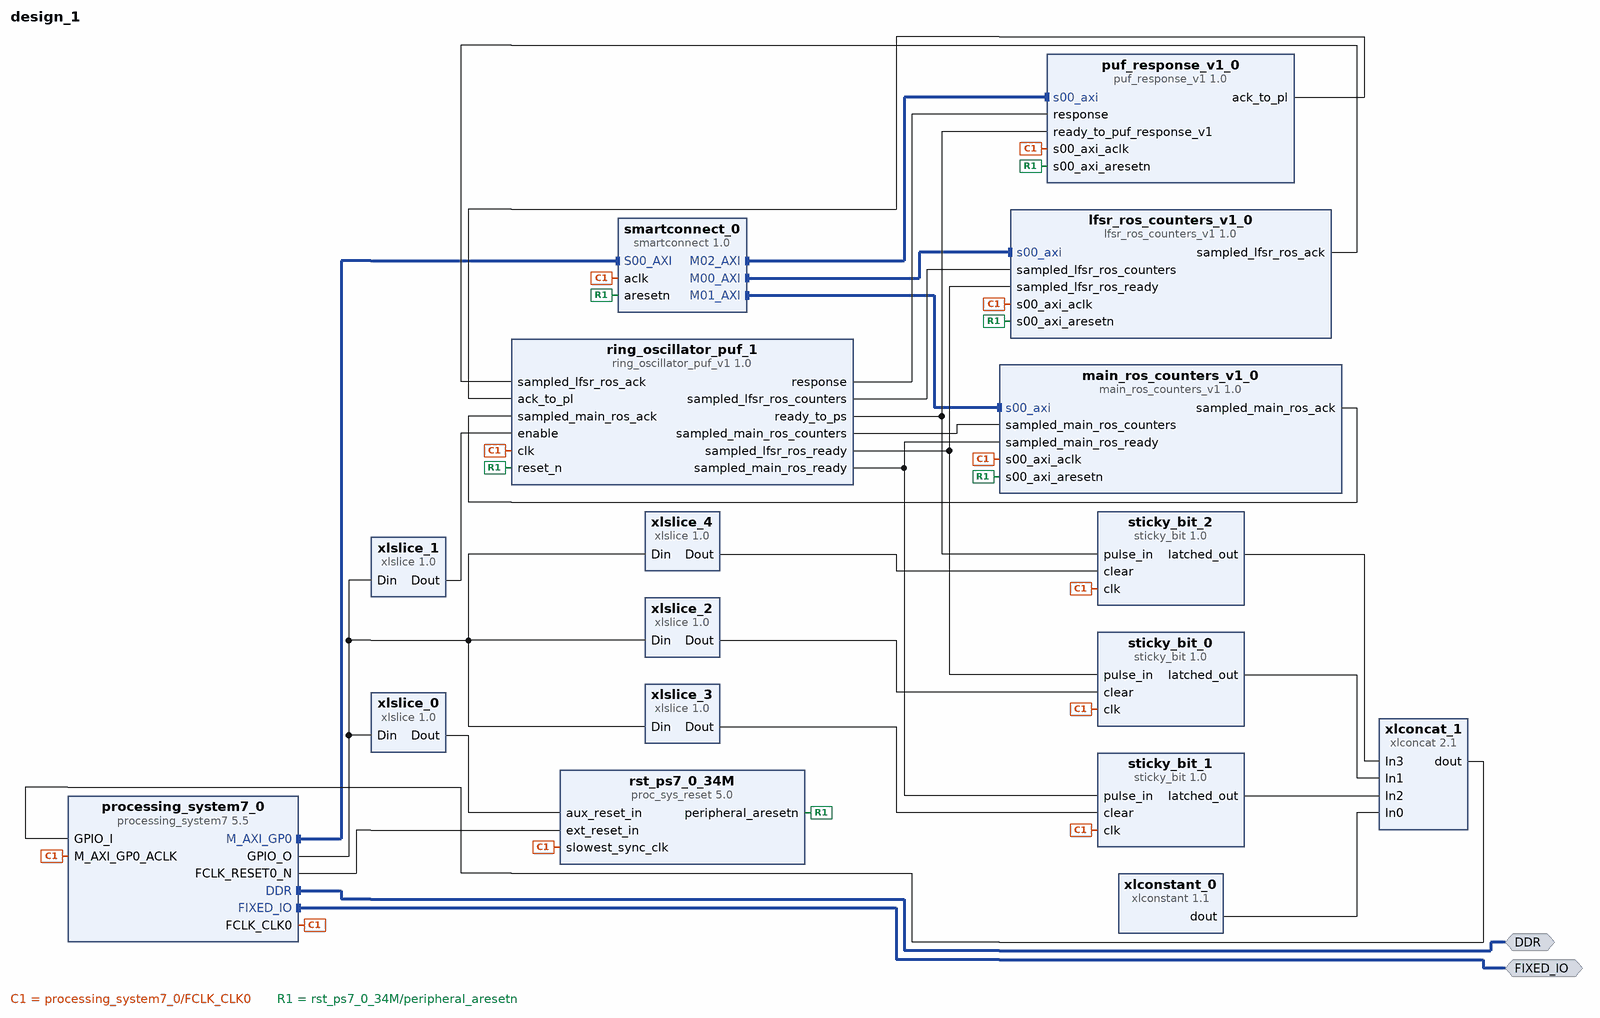
[diagram p0: block diagram of the top level]
# Vivado block design design_1, xc7z020clg400-1, Vivado 2022.1
create_bd_design design_1

create_bd_intf_port -mode Master -vlnv xilinx.com:interface:ddrx_rtl:1.0 DDR
create_bd_intf_port -mode Master -vlnv xilinx.com:display_processing_system7:fixedio_rtl:1.0 FIXED_IO

create_bd_cell -type ip -vlnv xilinx.com:ip:smartconnect:1.0 smartconnect_0
set_property -dict {CONFIG.NUM_MI 3 CONFIG.NUM_SI 1} [get_bd_cells smartconnect_0]
create_bd_cell -type ip -vlnv xilinx.com:ip:xlslice:1.0 xlslice_0
set_property -dict {CONFIG.DIN_WIDTH 8} [get_bd_cells xlslice_0]
create_bd_cell -type ip -vlnv xilinx.com:ip:xlslice:1.0 xlslice_1
set_property -dict {CONFIG.DIN_FROM 1 CONFIG.DIN_TO 1 CONFIG.DIN_WIDTH 8 CONFIG.DOUT_WIDTH 1} [get_bd_cells xlslice_1]
create_bd_cell -type ip -vlnv xilinx.com:ip:proc_sys_reset:5.0 rst_ps7_0_34M
create_bd_cell -type ip -vlnv xilinx.com:user:sticky_bit:1.0 sticky_bit_0
create_bd_cell -type ip -vlnv xilinx.com:user:sticky_bit:1.0 sticky_bit_1
create_bd_cell -type ip -vlnv xilinx.com:user:sticky_bit:1.0 sticky_bit_2
create_bd_cell -type ip -vlnv xilinx.com:ip:xlconcat:2.1 xlconcat_1
set_property -dict {CONFIG.NUM_PORTS 4} [get_bd_cells xlconcat_1]
create_bd_cell -type ip -vlnv xilinx.com:ip:xlconstant:1.1 xlconstant_0
set_property -dict {CONFIG.CONST_VAL 0 CONFIG.CONST_WIDTH 5} [get_bd_cells xlconstant_0]
create_bd_cell -type ip -vlnv xilinx.com:ip:xlslice:1.0 xlslice_2
set_property -dict {CONFIG.DIN_FROM 2 CONFIG.DIN_TO 2 CONFIG.DIN_WIDTH 8 CONFIG.DOUT_WIDTH 1} [get_bd_cells xlslice_2]
create_bd_cell -type ip -vlnv xilinx.com:ip:xlslice:1.0 xlslice_3
set_property -dict {CONFIG.DIN_FROM 3 CONFIG.DIN_TO 3 CONFIG.DIN_WIDTH 8 CONFIG.DOUT_WIDTH 1} [get_bd_cells xlslice_3]
create_bd_cell -type ip -vlnv xilinx.com:ip:xlslice:1.0 xlslice_4
set_property -dict {CONFIG.DIN_FROM 4 CONFIG.DIN_TO 4 CONFIG.DIN_WIDTH 8 CONFIG.DOUT_WIDTH 1} [get_bd_cells xlslice_4]
create_bd_cell -type ip -vlnv xilinx.com:ip:processing_system7:5.5 processing_system7_0
set_property -dict [list \
  CONFIG.PCW_APU_PERIPHERAL_FREQMHZ 666.666666 \
  CONFIG.PCW_CAN0_CAN0_IO {MIO 46 .. 47} \
  CONFIG.PCW_CAN0_PERIPHERAL_ENABLE 1 \
  CONFIG.PCW_CAN_PERIPHERAL_FREQMHZ 23.8095 \
  CONFIG.PCW_CRYSTAL_PERIPHERAL_FREQMHZ 50 \
  CONFIG.PCW_ENET0_ENET0_IO {MIO 16 .. 27} \
  CONFIG.PCW_ENET0_GRP_MDIO_ENABLE 1 \
  CONFIG.PCW_ENET0_GRP_MDIO_IO {MIO 52 .. 53} \
  CONFIG.PCW_ENET0_PERIPHERAL_ENABLE 1 \
  CONFIG.PCW_ENET0_PERIPHERAL_FREQMHZ {100 Mbps} \
  CONFIG.PCW_FPGA0_PERIPHERAL_FREQMHZ 50 \
  CONFIG.PCW_GPIO_EMIO_GPIO_ENABLE 1 \
  CONFIG.PCW_GPIO_EMIO_GPIO_IO 8 \
  CONFIG.PCW_GPIO_EMIO_GPIO_WIDTH 8 \
  CONFIG.PCW_GPIO_MIO_GPIO_ENABLE 0 \
  CONFIG.PCW_I2C0_GRP_INT_ENABLE 0 \
  CONFIG.PCW_I2C0_I2C0_IO {MIO 50 .. 51} \
  CONFIG.PCW_I2C0_PERIPHERAL_ENABLE 1 \
  CONFIG.PCW_I2C_PERIPHERAL_FREQMHZ 108.333336 \
  CONFIG.PCW_PRESET_BANK0_VOLTAGE {LVCMOS 1.8V} \
  CONFIG.PCW_PRESET_BANK1_VOLTAGE {LVCMOS 1.8V} \
  CONFIG.PCW_QSPI_GRP_FBCLK_ENABLE 1 \
  CONFIG.PCW_QSPI_GRP_FBCLK_IO {MIO 8} \
  CONFIG.PCW_QSPI_GRP_SINGLE_SS_ENABLE 1 \
  CONFIG.PCW_QSPI_GRP_SINGLE_SS_IO {MIO 1 .. 6} \
  CONFIG.PCW_QSPI_PERIPHERAL_ENABLE 1 \
  CONFIG.PCW_QSPI_QSPI_IO {MIO 1 .. 6} \
  CONFIG.PCW_SD0_GRP_CD_ENABLE 1 \
  CONFIG.PCW_SD0_GRP_CD_IO {MIO 0} \
  CONFIG.PCW_SD0_GRP_WP_ENABLE 1 \
  CONFIG.PCW_SD0_GRP_WP_IO {MIO 15} \
  CONFIG.PCW_SD0_PERIPHERAL_ENABLE 1 \
  CONFIG.PCW_SD0_SD0_IO {MIO 40 .. 45} \
  CONFIG.PCW_SDIO_PERIPHERAL_FREQMHZ 50 \
  CONFIG.PCW_SINGLE_QSPI_DATA_MODE x4 \
  CONFIG.PCW_UART1_PERIPHERAL_ENABLE 1 \
  CONFIG.PCW_UART1_UART1_IO {MIO 48 .. 49} \
  CONFIG.PCW_UART_PERIPHERAL_FREQMHZ 50 \
  CONFIG.PCW_UIPARAM_DDR_FREQ_MHZ 533.333333 \
  CONFIG.PCW_UIPARAM_DDR_PARTNO {MT41J256M8 HX-15E} \
  CONFIG.PCW_USB0_PERIPHERAL_ENABLE 1 \
  CONFIG.PCW_USB0_USB0_IO {MIO 28 .. 39} \
  CONFIG.preset ZC702 \
] [get_bd_cells processing_system7_0]
# 203 more settings of processing_system7_0 are not shown: defaults, MIO pin electricals, DDR timing, and values the tool derives
create_bd_cell -type ip -vlnv user.com:user:lfsr_ros_counters_v1:1.0 lfsr_ros_counters_v1_0
create_bd_cell -type ip -vlnv user.com:user:main_ros_counters_v1:1.0 main_ros_counters_v1_0
create_bd_cell -type ip -vlnv user.com:user:puf_response_v1:1.0 puf_response_v1_0
create_bd_cell -type ip -vlnv xilinx.com:user:ring_oscillator_puf_v1:1.0 ring_oscillator_puf_1
set_property -dict {CONFIG.g_clk_freq 50000000} [get_bd_cells ring_oscillator_puf_1]

# ---- connections ----

connect_bd_intf_net [get_bd_intf_ports DDR] [get_bd_intf_pins processing_system7_0/DDR]
connect_bd_intf_net [get_bd_intf_ports FIXED_IO] [get_bd_intf_pins processing_system7_0/FIXED_IO]
connect_bd_intf_net -intf_net processing_system7_1_M_AXI_GP0 [get_bd_intf_pins processing_system7_0/M_AXI_GP0] [get_bd_intf_pins smartconnect_0/S00_AXI]
connect_bd_intf_net [get_bd_intf_pins smartconnect_0/M00_AXI] [get_bd_intf_pins lfsr_ros_counters_v1_0/s00_axi]
connect_bd_intf_net [get_bd_intf_pins smartconnect_0/M01_AXI] [get_bd_intf_pins main_ros_counters_v1_0/s00_axi]
connect_bd_intf_net [get_bd_intf_pins puf_response_v1_0/s00_axi] [get_bd_intf_pins smartconnect_0/M02_AXI]
connect_bd_net [get_bd_pins lfsr_ros_counters_v1_0/sampled_lfsr_ros_ack] [get_bd_pins ring_oscillator_puf_1/sampled_lfsr_ros_ack]
connect_bd_net [get_bd_pins main_ros_counters_v1_0/sampled_main_ros_ack] [get_bd_pins ring_oscillator_puf_1/sampled_main_ros_ack]
connect_bd_net [get_bd_pins processing_system7_0/FCLK_CLK0] \
  [get_bd_pins smartconnect_0/aclk] [get_bd_pins rst_ps7_0_34M/slowest_sync_clk] [get_bd_pins sticky_bit_0/clk] \
  [get_bd_pins sticky_bit_1/clk] [get_bd_pins sticky_bit_2/clk] [get_bd_pins processing_system7_0/M_AXI_GP0_ACLK] \
  [get_bd_pins lfsr_ros_counters_v1_0/s00_axi_aclk] [get_bd_pins main_ros_counters_v1_0/s00_axi_aclk] \
  [get_bd_pins puf_response_v1_0/s00_axi_aclk] [get_bd_pins ring_oscillator_puf_1/clk]
connect_bd_net -net processing_system7_1_FCLK_RESET0_N [get_bd_pins processing_system7_0/FCLK_RESET0_N] [get_bd_pins rst_ps7_0_34M/ext_reset_in]
connect_bd_net -net processing_system7_1_GPIO_O [get_bd_pins processing_system7_0/GPIO_O] \
  [get_bd_pins xlslice_1/Din] [get_bd_pins xlslice_0/Din] [get_bd_pins xlslice_3/Din] [get_bd_pins xlslice_2/Din] \
  [get_bd_pins xlslice_4/Din]
connect_bd_net [get_bd_pins puf_response_v1_0/ack_to_pl] [get_bd_pins ring_oscillator_puf_1/ack_to_pl]
connect_bd_net [get_bd_pins ring_oscillator_puf_1/ready_to_ps] \
  [get_bd_pins sticky_bit_2/pulse_in] [get_bd_pins puf_response_v1_0/ready_to_puf_response_v1]
connect_bd_net [get_bd_pins ring_oscillator_puf_1/response] [get_bd_pins puf_response_v1_0/response]
connect_bd_net [get_bd_pins ring_oscillator_puf_1/sampled_lfsr_ros_counters] [get_bd_pins lfsr_ros_counters_v1_0/sampled_lfsr_ros_counters]
connect_bd_net [get_bd_pins ring_oscillator_puf_1/sampled_lfsr_ros_ready] \
  [get_bd_pins sticky_bit_0/pulse_in] [get_bd_pins lfsr_ros_counters_v1_0/sampled_lfsr_ros_ready]
connect_bd_net [get_bd_pins ring_oscillator_puf_1/sampled_main_ros_counters] [get_bd_pins main_ros_counters_v1_0/sampled_main_ros_counters]
connect_bd_net [get_bd_pins ring_oscillator_puf_1/sampled_main_ros_ready] \
  [get_bd_pins sticky_bit_1/pulse_in] [get_bd_pins main_ros_counters_v1_0/sampled_main_ros_ready]
connect_bd_net [get_bd_pins rst_ps7_0_34M/peripheral_aresetn] \
  [get_bd_pins smartconnect_0/aresetn] [get_bd_pins lfsr_ros_counters_v1_0/s00_axi_aresetn] \
  [get_bd_pins main_ros_counters_v1_0/s00_axi_aresetn] [get_bd_pins puf_response_v1_0/s00_axi_aresetn] \
  [get_bd_pins ring_oscillator_puf_1/reset_n]
connect_bd_net [get_bd_pins sticky_bit_0/latched_out] [get_bd_pins xlconcat_1/In1]
connect_bd_net [get_bd_pins sticky_bit_1/latched_out] [get_bd_pins xlconcat_1/In2]
connect_bd_net [get_bd_pins sticky_bit_2/latched_out] [get_bd_pins xlconcat_1/In3]
connect_bd_net [get_bd_pins xlconcat_1/dout] [get_bd_pins processing_system7_0/GPIO_I]
connect_bd_net [get_bd_pins xlconstant_0/dout] [get_bd_pins xlconcat_1/In0]
connect_bd_net [get_bd_pins xlslice_0/Dout] [get_bd_pins rst_ps7_0_34M/aux_reset_in]
connect_bd_net [get_bd_pins xlslice_1/Dout] [get_bd_pins ring_oscillator_puf_1/enable]
connect_bd_net [get_bd_pins xlslice_2/Dout] [get_bd_pins sticky_bit_0/clear]
connect_bd_net [get_bd_pins xlslice_3/Dout] [get_bd_pins sticky_bit_1/clear]
connect_bd_net [get_bd_pins xlslice_4/Dout] [get_bd_pins sticky_bit_2/clear]

# ---- address map ----
assign_bd_address -offset 0x40000000 -range 4K -target_address_space [get_bd_addr_spaces processing_system7_0/Data] [get_bd_addr_segs lfsr_ros_counters_v1_0/s00_axi/reg0]
assign_bd_address -offset 0x40001000 -range 4K -target_address_space [get_bd_addr_spaces processing_system7_0/Data] [get_bd_addr_segs main_ros_counters_v1_0/s00_axi/reg0]
assign_bd_address -offset 0x40002000 -range 4K -target_address_space [get_bd_addr_spaces processing_system7_0/Data] [get_bd_addr_segs puf_response_v1_0/s00_axi/reg0]

validate_bd_design
save_bd_design
